# Altium schematic sheet 遥控器.SchDoc
size A1
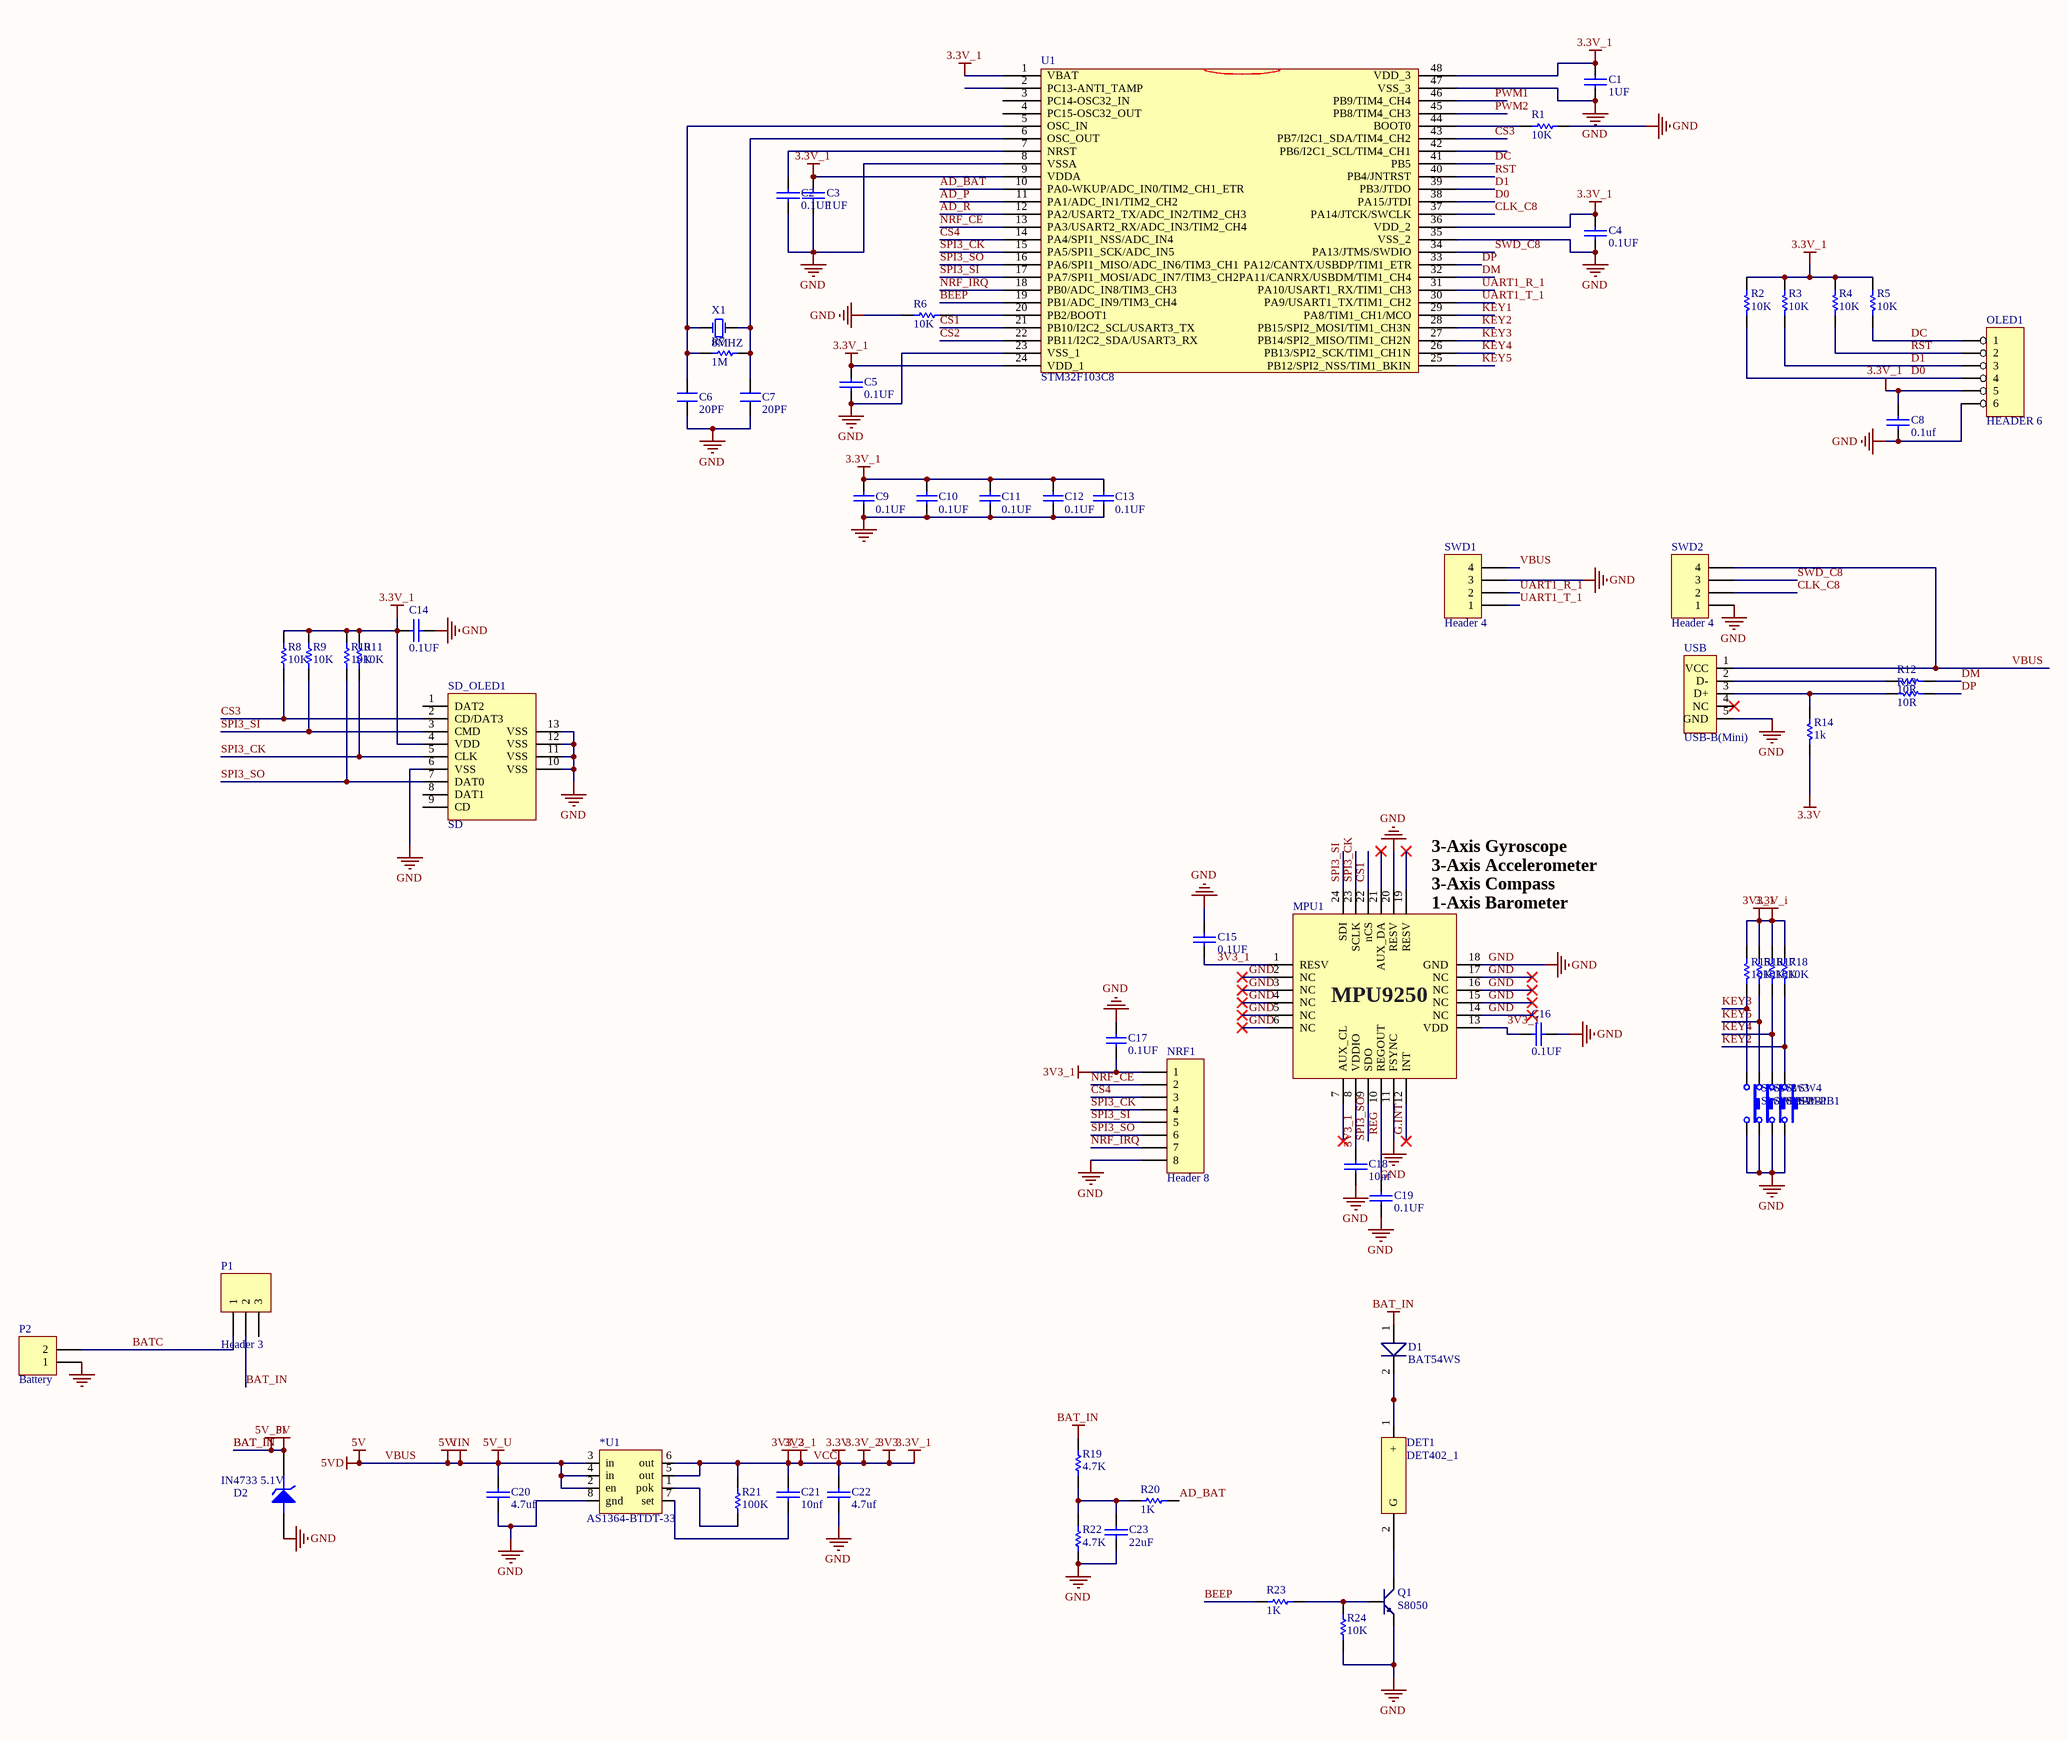
[diagram p0: 遥控器.SchDoc]

## Parts
*U1  AS1364-BTDT-33  [TDFN-8]
C1  1UF  [C 0402]
C2  0.1UF  [C 0402]
C3  1UF  [C 0402]
C4  0.1UF  [C 0402]
C5  0.1UF  [C 0402]
C6  20PF  [C 0402]
C7  20PF  [C 0402]
C8  0.1uf  [C 0402]
C9  0.1UF  [C 0402]
C10  0.1UF  [C 0402]
C11  0.1UF  [C 0402]
C12  0.1UF  [C 0402]
C13  0.1UF  [C 0402]
C14  0.1UF  [C 0402]
C15  0.1UF  [C 0402]
C16  0.1UF  [C 0402]
C17  0.1UF  [C 0402]
C18  10nf  [C 0402]
C19  0.1UF  [C 0402]
C20  4.7uf  [C 0402]
C21  10nf  [C 0402]
C22  4.7uf  [C 0402]
C23  22uF  [C 0402]
D1  BAT54WS  [SOD-323]
D2  IN4733 5.1V  [1n4148-SOD123]
DET1  DET402_1  [DET402]
MPU1  MPU9250  [MPU_QFN24_0.4]
NRF1  Header 8  [NRF]
OLED1  HEADER 6  [HDR1X6]
P1  Header 3  [HDR1X3]
P2  Battery  [HDR1X2]
Q1  S8050  [SOT-23R]
R1  value 10K  [R 0402]  (hidden comment: 1K)
R2  10K  [R 0402]
R3  10K  [R 0402]
R4  10K  [R 0402]
R5  10K  [R 0402]
R6  value 10K  [R 0402]  (hidden comment: 1K)
R7  1M  [R 0402]
R8  10K  [R 0402]
R9  10K  [R 0402]
R10  10K  [R 0402]
R11  10K  [R 0402]
R12  10R  [R 0402]
R13  10R  [R 0402]
R14  1k  [R 0402]
R15  10K  [R 0402]
R16  10K  [R 0402]
R17  10K  [R 0402]
R18  10K  [R 0402]
R19  4.7K  [R 0402]
R20  1K  [R 0402]
R21  value 100K  [R 0402]  (hidden comment: 1K)
R22  4.7K  [R 0402]
R23  1K  [R 0402]
R24  10K  [R 0402]
SD_OLED1  SD  [TF-MicroSD]
SW1  SW-PB1  [KEY_SAD]
SW2  SW-PB1  [KEY_SAD]
SW3  SW-PB1  [KEY_SAD]
SW4  SW-PB1  [KEY_SAD]
SWD1  Header 4  [JST_GH_V4]
SWD2  Header 4  [HDR1X4]
U1  STM32F103C8  [LQFP48S]
USB  USB-B(Mini)  [USB/SM0.8-6H5_M]
X1  8MHZ  [PXCL]

## Nets
3V3_1: *U1.5(out) *U1.6(out) C1.2 C3.2 C4.2 C5.2 C8.2 C9.1 C10.1 C11.1 C12.1 C13.1 C14.2 C15.1 C16.1 C17.1 C18.2 C21.1 C22.1 MPU1.1(RESV) MPU1.8(VDDIO) MPU1.13(VDD) NRF1.1 OLED1.5 R2.2 R3.2 R4.2 R5.2 R8.1 R9.1 R10.1 R11.1 R14.1 R15.2 R16.2 R17.2 R18.2 R21.1 SD_OLED1.4(VDD) U1.1(VBAT) U1.9(VDDA) U1.24(VDD_1) U1.36(VDD_2) U1.48(VDD_3)  [also labelled 3.3V, 3.3V_1, 3.3V_2, 3.3V_i, 3V3, 3V3_2, VCC]
BAT_IN: *U1.2(en) *U1.3(in) *U1.4(in) C20.1 D1.1 D2.2(K) P1.2 R19.2 SWD1.4 SWD2.4 USB.1(VCC)  [also labelled 5V, 5V_PI, 5V_U, 5VD, 5Vi, VBUS, VIN]
GND: *U1.8(gnd) C1.1 C2.1 C3.1 C4.1 C5.1 C6.1 C7.1 C8.1 C9.2 C10.2 C11.2 C12.2 C13.2 C14.1 C15.2 C16.2 C17.2 C18.1 C19.1 C20.2 C22.2 C23.2 D2.1(A) MPU1.2(NC) MPU1.3(NC) MPU1.4(NC) MPU1.5(NC) MPU1.6(NC) MPU1.11(FSYNC) MPU1.14(NC) MPU1.15(NC) MPU1.16(NC) MPU1.17(NC) MPU1.18(GND) MPU1.20(RESV) NRF1.8 OLED1.6 P2.1 Q1.1(E) R1.2 R6.1 R22.1 R24.1 SD_OLED1.6(VSS) SD_OLED1.10(VSS) SD_OLED1.11(VSS) SD_OLED1.12(VSS) SD_OLED1.13(VSS) SW1.1 SW2.1 SW3.1 SW4.1 SWD1.3 SWD2.1 U1.8(VSSA) U1.23(VSS_1) U1.35(VSS_2) U1.47(VSS_3) USB.5(GND)
AD_BAT: R20.1 U1.10(PA0-WKUP/ADC_IN0/TIM2_CH1_ETR)
AD_P: U1.11(PA1/ADC_IN1/TIM2_CH2)
AD_R: U1.12(PA2/USART2_TX/ADC_IN2/TIM2_CH3)
BATC: P1.1 P2.2
BEEP: R23.2 U1.19(PB1/ADC_IN9/TIM3_CH4)
CLK_C8: SWD2.2 U1.37(PA14/JTCK/SWCLK)
CS1: MPU1.22(nCS) U1.21(PB10/I2C2_SCL/USART3_TX)
CS2: U1.22(PB11/I2C2_SDA/USART3_RX)
CS3: R8.2 SD_OLED1.2(CD/DAT3) U1.43(PB7/I2C1_SDA/TIM4_CH2)
CS4: NRF1.3 U1.14(PA4/SPI1_NSS/ADC_IN4)
D0: OLED1.4 R2.1 U1.38(PA15/JTDI)
D1: OLED1.3 R3.1 U1.39(PB3/JTDO)
DC: OLED1.1 R5.1 U1.41(PB5)
DM: R12.2 U1.32(PA11/CANRX/USBDM/TIM1_CH4)
DP: R13.2 U1.33(PA12/CANTX/USBDP/TIM1_ETR)
G.INT: MPU1.12(INT)
KEY1: U1.29(PA8/TIM1_CH1/MCO)
KEY2: R18.1 SW4.2 U1.28(PB15/SPI2_MOSI/TIM1_CH3N)
KEY3: R15.1 SW1.2 U1.27(PB14/SPI2_MISO/TIM1_CH2N)
KEY4: R17.1 SW3.2 U1.26(PB13/SPI2_SCK/TIM1_CH1N)
KEY5: R16.1 SW2.2 U1.25(PB12/SPI2_NSS/TIM1_BKIN)
NRF_CE: NRF1.2 U1.13(PA3/USART2_RX/ADC_IN3/TIM2_CH4)
NRF_IRQ: NRF1.7 U1.18(PB0/ADC_IN8/TIM3_CH3)
PWM1: U1.46(PB9/TIM4_CH4)
PWM2: U1.45(PB8/TIM4_CH3)
REG: C19.2 MPU1.10(REGOUT)
RST: OLED1.2 R4.1 U1.40(PB4/JNTRST)
SPI3_CK: MPU1.23(SCLK) NRF1.4 R11.2 SD_OLED1.5(CLK) U1.15(PA5/SPI1_SCK/ADC_IN5)
SPI3_SI: MPU1.24(SDI) NRF1.5 R9.2 SD_OLED1.3(CMD) U1.17(PA7/SPI1_MOSI/ADC_IN7/TIM3_CH2)
SPI3_SO: MPU1.9(SDO) NRF1.6 R10.2 SD_OLED1.7(DAT0) U1.16(PA6/SPI1_MISO/ADC_IN6/TIM3_CH1)
SWD_C8: SWD2.3 U1.34(PA13/JTMS/SWDIO)
UART1_R_1: SWD1.2 U1.31(PA10/USART1_RX/TIM1_CH3)
UART1_T_1: SWD1.1 U1.30(PA9/USART1_TX/TIM1_CH2)
Net*U1_1: *U1.1(pok) R21.2
Net*U1_7: *U1.7(set) C21.2
NetC2_2: C2.2 U1.7(NRST)
NetC6_2: C6.2 R7.1 U1.5(OSC_IN) X1.1(OSC1)
NetC7_2: C7.2 R7.2 U1.6(OSC_OUT) X1.2(OSC2)
NetC23_1: C23.1 R19.1 R20.2 R22.2
NetD1_2: D1.2 DET1.1(+)
NetDET1_2: DET1.2(G) Q1.3(C)
NetQ1_2: Q1.2(B) R23.1 R24.2
NetR1_1: R1.1 U1.44(BOOT0)
NetR6_2: R6.2 U1.20(PB2/BOOT1)
NetR12_1: R12.1 USB.2(D-)
NetR13_1: R13.1 R14.2 USB.3(D+)

Not connected (* = marked no-connect by the designer): MPU1 7(AUX_CL)* 19(RESV)* 21(AUX_DA)*; P1 3; SD_OLED1 1(DAT2) 8(DAT1) 9(CD); U1 2(PC13-ANTI_TAMP) 3(PC14-OSC32_IN) 4(PC15-OSC32_OUT) 42(PB6/I2C1_SCL/TIM4_CH1); USB 4(NC)*

## Notes on the sheet
- 3-Axis Gyroscope
- (near MPU1) 3-Axis Accelerometer
- (near MPU1) 3-Axis Compass
- (near MPU1) 1-Axis Barometer

## Library data of the parts
*U1 = AS1364-3.3V
C1-C5 C8 C14-C16 C18-C23 = CAP: Capacitor
C6 C7 = C2: 0805
C9-C13 C17 = CAP: Capacitor; Value: 100nF; Published: 8-Jun-2000; Revision: July-2002: Re-released for DXP Platform.; Publisher: Altium Limited
D1 = BAT54: 单肖特基二极管
D2 = ZENER3: Zener Diode
MPU1 = MPU9250: Sensor
NRF1 = Header 8: Header, 8-Pin; LatestRevisionDate: 17-Jul-2002; LatestRevisionNote: Re-released for DXP Platform.; Publisher: Altium Limited
P1 = Header 3: Header, 3-Pin; LatestRevisionDate: 17-Jul-2002; LatestRevisionNote: Re-released for DXP Platform.; Publisher: Altium Limited
P2 = Header 2: Header, 2-Pin; LatestRevisionDate: 17-Jul-2002; LatestRevisionNote: Re-released for DXP Platform.; Publisher: Altium Limited
Q1 = NPN: 8050/BCW846/BCW847
R1 R6 R15-R18 R21 = Res1: Resistor; Published: 8-Jun-2000; Revision: July-2002: Re-released for DXP Platform.; Publisher: Altium Limited
  R15-R18: Value: 10K
R2-R5 R7-R14 R19 R20 R22-R24 = Res2: 0603
SD_OLED1 = TF-MicroSD
SW1-SW4 = S: 按键
SWD1 SWD2 = Header 4: Header, 4-Pin; LatestRevisionDate: 17-Jul-2002; LatestRevisionNote: Re-released for DXP Platform.; Publisher: Altium Limited
U1 = STM32F103C6
USB = USB5
X1 = XTAL: Crystal Oscillator; Published: 8-Jun-2000; LatestRevisionDate: 17-Jul-2002; LatestRevisionNote: Re-released for DXP Platform.; Publisher: Altium Limited